# EasyEDA Pro project ProPrj_PCB_PCB_PCB-NFC-Card_2026-06-03_2026-06-03.epro

# Board PCB_PCB_PCB-NFC-Card_2026-06-03
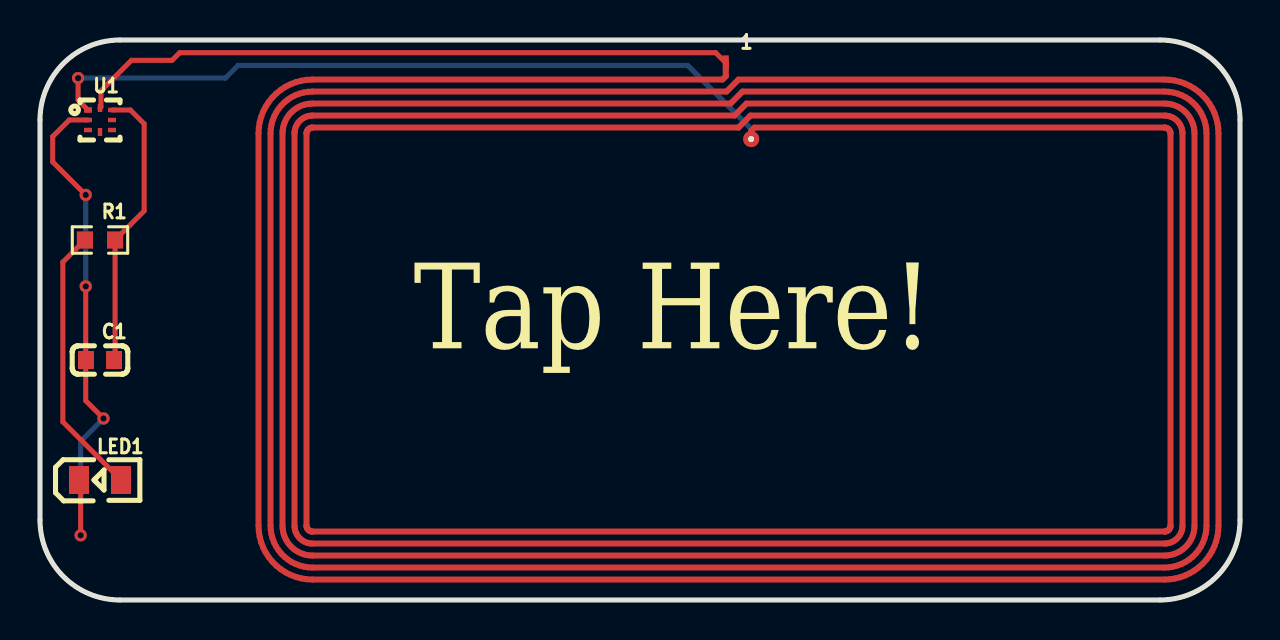
[diagram p0: board, top side]
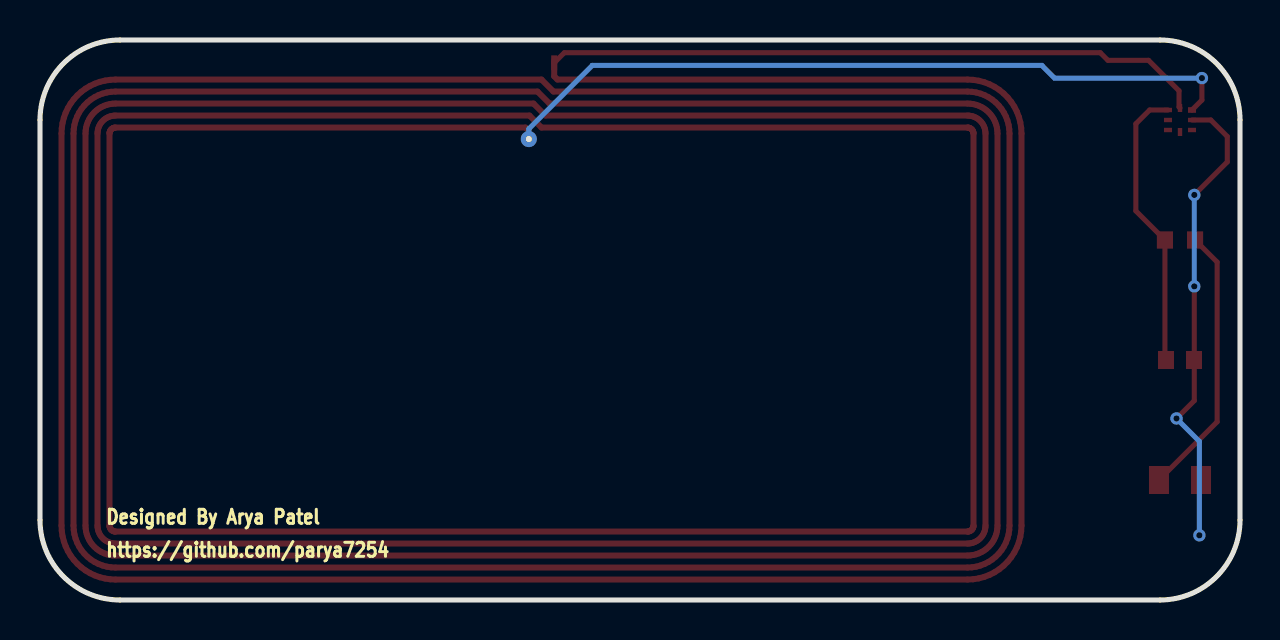
[diagram p1: board, bottom side, seen from below]

Outline 60 x 28 mm; copper layers: Top Layer, Bottom Layer. Coordinates in mm from the lower left corner of the outline.
Outline path: 0,24 arc(1.17,26.83) 4,28 56,28 arc(58.83,26.83) 60,24 60,4 arc(58.83,1.17) 56,0 4,0 arc(1.17,1.17) 0,4 0,24
Stack: Top Layer 0.035mm / Bottom Layer 0.035mm

## Design rules (mm)
spacing Default (default): track to track 0.102, other pairs 0 to 0.3
track width Default (default): min 0.254, default 0.254, max 25.4
differential pair differentialPair (default): width min 0.127, default 2.54, max 2.54; gap min 0.127, default 0.152

## Placement (name value [footprint] x y rotation side)
1  -  [25X48MM_NFC_ANTENNA]  34.92 13.52 0 top
C1  220nF  [C0603]  3 12 0 top
LED1  0805G (Green)  [LED0805-R-RD]  3 6 0 top
R1  47Ω  [R0603]  3 18 0 top
U1  NT3H2111W0FHKH  [XQFN-8_L1.6-W1.6-P0.50-BL_NT3H2111W0FHKH]  3 24 0 top

## Footprints (pads in the part's own frame, mm; a bottom-side part is the same pattern mirrored in y, then rotated)
25X48MM_NFC_ANTENNA
  rect 0.3x0.75 smd: P$1(-0.635,13.335)
  round 0.808 hole 0.3x0.3: P$2(0.635,9.525)
C0603
  rect 0.8x0.9 smd: 1(-0.7,0) 2(0.7,0)
LED0805-R-RD
  rect 1x1.399 smd: 1(1.05,0) 2(-1.05,0)
R0603
  rect 0.806x0.864 smd: 1(-0.753,0) 2(0.753,0)
XQFN-8_L1.6-W1.6-P0.50-BL_NT3H2111W0FHKH
  rect 0.4x0.28 smd: 1(-0.6,0.5)
  rect 0.4x0.22 smd: 2(-0.6,0) 3(-0.6,-0.5) 5(0.6,-0.5) 6(0.6,0) 7(0.6,0.5)
  rect 0.22x0.4 smd: 4(0,-0.6) 8(0,0.6)

## Nets
LED1_1: LED1.1 R1.1
U1_1: 1.P$2 U1.1
U1_2: C1.1 LED1.2 U1.2
U1_3: U1.3
U1_4: U1.4
U1_5: U1.5
U1_6: U1.6
U1_7: C1.2 R1.2 U1.7
U1_8: 1.P$1 U1.8

## Via types
v1: diameter 0.62, hole 0.31, Top Layer to Bottom Layer, 5 vias

## Routing (per net, layer and track width the routed paths; a pad name or vN(x,y) marks a point on that pad's centre or on a via; arc(x,y) is an arc through that point)
LED1_1: length 13.7
  Top Layer w0.254: LED1.1 1.14,8.91 1.14,16.9 R1.1
U1_1: length 37.5
  Top Layer w0.254: v1(1.91,26.09) 1.91,24.99 U1.1
  Bottom Layer w0.254: 1.P$2 35.56,23.55 32.38,26.73 9.91,26.73 9.27,26.09 v1(1.91,26.09)
U1_2: length 26.4
  Top Layer w0.254: v1(2.29,15.68) 2.29,12.01 C1.1 2.29,11.99 2.29,9.97 v1(3.17,9.08) ; v1(2.29,20.25) 0.63,21.9 0.63,23.17 1.46,24 U1.2 ; v1(2.03,3.23) 2.03,5.92 LED1.2
  Bottom Layer w0.254: v1(2.29,15.68) v1(2.29,20.25) ; v1(3.17,9.08) 2.03,7.93 v1(2.03,3.23)
U1_7: length 14.3
  Top Layer w0.254: C1.2 3.75,12.05 R1.2 5.21,19.45 5.21,23.81 4.52,24.5 U1.7
U1_8: length 33.1
  Top Layer w0.254: U1.8 3.05,24.65 3.05,25.46 4.57,26.98 6.6,26.98 6.98,27.36 33.78,27.36 1.P$1

## Text on the board
Bottom Silkscreen Layer: Designed By Arya Patel | https://github.com/parya7254
Top Solder Mask Layer: Tap Here!
Top Silkscreen Layer: Tap Here!
